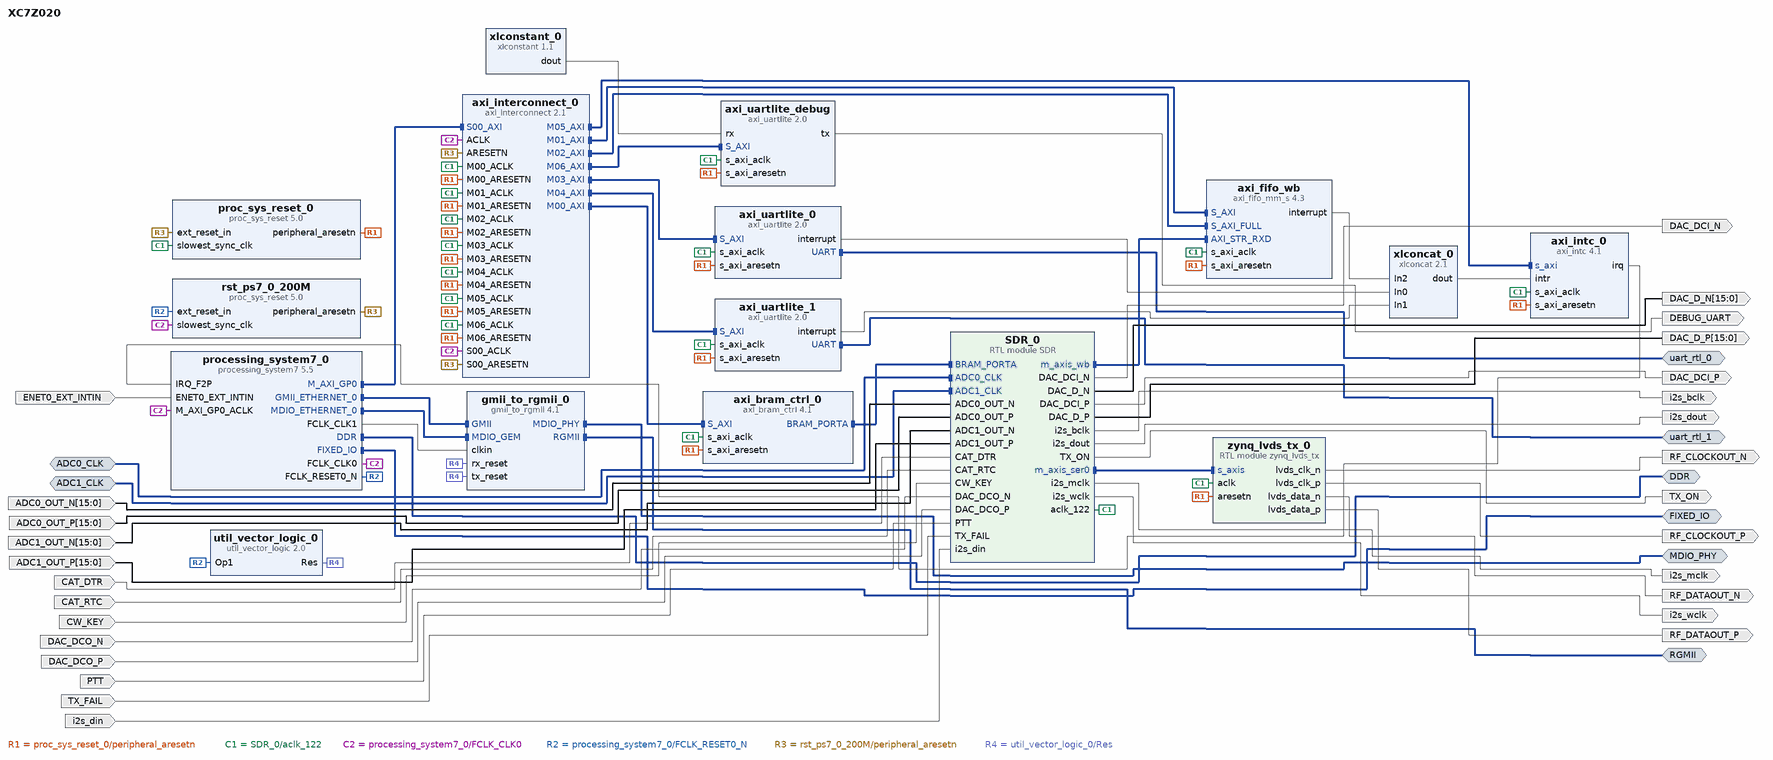
[diagram p0: block diagram of the top level]
# Vivado block design XC7Z020, xc7z020clg484-1, Vivado 2023.2
create_bd_design XC7Z020

create_bd_intf_port -mode Master -vlnv xilinx.com:interface:ddrx_rtl:1.0 DDR
create_bd_intf_port -mode Master -vlnv xilinx.com:display_processing_system7:fixedio_rtl:1.0 FIXED_IO
create_bd_intf_port -mode Slave -vlnv xilinx.com:interface:diff_clock_rtl:1.0 ADC1_CLK
set_property -dict {CONFIG.FREQ_HZ 122880000} [get_bd_intf_ports ADC1_CLK]
create_bd_intf_port -mode Master -vlnv xilinx.com:interface:mdio_rtl:1.0 MDIO_PHY
create_bd_intf_port -mode Master -vlnv xilinx.com:interface:rgmii_rtl:1.0 RGMII
create_bd_intf_port -mode Slave -vlnv xilinx.com:interface:diff_clock_rtl:1.0 ADC0_CLK
set_property -dict {CONFIG.FREQ_HZ 122880000} [get_bd_intf_ports ADC0_CLK]
create_bd_intf_port -mode Master -vlnv xilinx.com:interface:uart_rtl:1.0 uart_rtl_0
create_bd_intf_port -mode Master -vlnv xilinx.com:interface:uart_rtl:1.0 uart_rtl_1
create_bd_port -dir I -type intr ENET0_EXT_INTIN
set_property -dict {CONFIG.SENSITIVITY EDGE_RISING} [get_bd_ports ENET0_EXT_INTIN]
create_bd_port -dir I -from 15 -to 0 ADC0_OUT_N
create_bd_port -dir I -from 15 -to 0 ADC0_OUT_P
create_bd_port -dir I -from 15 -to 0 ADC1_OUT_N
create_bd_port -dir I -from 15 -to 0 ADC1_OUT_P
create_bd_port -dir I DAC_DCO_P
create_bd_port -dir I DAC_DCO_N
create_bd_port -dir I i2s_din
create_bd_port -dir O i2s_dout
create_bd_port -dir O i2s_wclk
create_bd_port -dir O i2s_bclk
create_bd_port -dir O i2s_mclk
create_bd_port -dir O -from 15 -to 0 DAC_D_P
create_bd_port -dir O -from 15 -to 0 DAC_D_N
create_bd_port -dir O DAC_DCI_P
create_bd_port -dir O DAC_DCI_N
create_bd_port -dir I TX_FAIL
create_bd_port -dir O TX_ON
create_bd_port -dir O DEBUG_UART
create_bd_port -dir I PTT
create_bd_port -dir I CW_KEY
create_bd_port -dir I CAT_DTR
create_bd_port -dir I CAT_RTC
create_bd_port -dir O RF_DATAOUT_N
create_bd_port -dir O RF_DATAOUT_P
create_bd_port -dir O RF_CLOCKOUT_N
create_bd_port -dir O RF_CLOCKOUT_P

create_bd_cell -type ip -vlnv xilinx.com:ip:processing_system7:5.5 processing_system7_0
set_property -dict [list \
  CONFIG.PCW_APU_PERIPHERAL_FREQMHZ 666.666666 \
  CONFIG.PCW_ENET0_ENET0_IO EMIO \
  CONFIG.PCW_ENET0_GRP_MDIO_ENABLE 1 \
  CONFIG.PCW_ENET0_GRP_MDIO_IO EMIO \
  CONFIG.PCW_ENET0_PERIPHERAL_ENABLE 1 \
  CONFIG.PCW_ENET_RESET_ENABLE 0 \
  CONFIG.PCW_EN_CLK1_PORT 1 \
  CONFIG.PCW_FCLK_CLK1_BUF TRUE \
  CONFIG.PCW_FPGA0_PERIPHERAL_FREQMHZ 100 \
  CONFIG.PCW_FPGA1_PERIPHERAL_FREQMHZ 200 \
  CONFIG.PCW_FPGA_FCLK1_ENABLE 1 \
  CONFIG.PCW_GPIO_EMIO_GPIO_ENABLE 1 \
  CONFIG.PCW_GPIO_EMIO_GPIO_IO 7 \
  CONFIG.PCW_GPIO_EMIO_GPIO_WIDTH 7 \
  CONFIG.PCW_GPIO_MIO_GPIO_ENABLE 1 \
  CONFIG.PCW_GPIO_MIO_GPIO_IO MIO \
  CONFIG.PCW_I2C0_GRP_INT_ENABLE 0 \
  CONFIG.PCW_I2C0_I2C0_IO {MIO 14 .. 15} \
  CONFIG.PCW_I2C0_PERIPHERAL_ENABLE 1 \
  CONFIG.PCW_I2C_PERIPHERAL_FREQMHZ 111.111115 \
  CONFIG.PCW_I2C_RESET_ENABLE 0 \
  CONFIG.PCW_IRQ_F2P_INTR 1 \
  CONFIG.PCW_PERIPHERAL_BOARD_PRESET None \
  CONFIG.PCW_PRESET_BANK1_VOLTAGE {LVCMOS 3.3V} \
  CONFIG.PCW_QSPI_GRP_SINGLE_SS_ENABLE 1 \
  CONFIG.PCW_QSPI_GRP_SINGLE_SS_IO {MIO 1 .. 6} \
  CONFIG.PCW_QSPI_PERIPHERAL_ENABLE 1 \
  CONFIG.PCW_QSPI_QSPI_IO {MIO 1 .. 6} \
  CONFIG.PCW_SD0_PERIPHERAL_ENABLE 0 \
  CONFIG.PCW_SINGLE_QSPI_DATA_MODE x4 \
  CONFIG.PCW_SPI0_PERIPHERAL_ENABLE 1 \
  CONFIG.PCW_SPI0_SPI0_IO {MIO 16 .. 21} \
  CONFIG.PCW_SPI1_GRP_SS1_ENABLE 1 \
  CONFIG.PCW_SPI1_GRP_SS2_ENABLE 1 \
  CONFIG.PCW_SPI1_PERIPHERAL_ENABLE 1 \
  CONFIG.PCW_SPI1_SPI1_IO {MIO 34 .. 39} \
  CONFIG.PCW_TTC0_PERIPHERAL_ENABLE 1 \
  CONFIG.PCW_TTC0_TTC0_IO EMIO \
  CONFIG.PCW_UART0_PERIPHERAL_ENABLE 1 \
  CONFIG.PCW_UART0_UART0_IO {MIO 10 .. 11} \
  CONFIG.PCW_UART1_PERIPHERAL_ENABLE 1 \
  CONFIG.PCW_UART1_UART1_IO {MIO 48 .. 49} \
  CONFIG.PCW_UART_PERIPHERAL_FREQMHZ 100 \
  CONFIG.PCW_UIPARAM_DDR_BUS_WIDTH {16 Bit} \
  CONFIG.PCW_UIPARAM_DDR_FREQ_MHZ 533.333333 \
  CONFIG.PCW_UIPARAM_DDR_PARTNO {MT41K256M16 RE-125} \
  CONFIG.PCW_USB0_PERIPHERAL_ENABLE 0 \
  CONFIG.PCW_USB_RESET_ENABLE 0 \
  CONFIG.PCW_USE_FABRIC_INTERRUPT 1 \
  CONFIG.preset None \
] [get_bd_cells processing_system7_0]
# 515 more settings of processing_system7_0 are not shown: defaults, MIO pin electricals, DDR timing, and values the tool derives
create_bd_cell -type ip -vlnv xilinx.com:ip:gmii_to_rgmii:4.1 gmii_to_rgmii_0
set_property -dict {CONFIG.RGMII_TXC_SKEW 2 CONFIG.SupportLevel Include_Shared_Logic_in_Core} [get_bd_cells gmii_to_rgmii_0]
create_bd_cell -type ip -vlnv xilinx.com:ip:util_vector_logic:2.0 util_vector_logic_0
set_property -dict {CONFIG.C_OPERATION not CONFIG.C_SIZE 1} [get_bd_cells util_vector_logic_0]
create_bd_cell -type ip -vlnv xilinx.com:ip:axi_bram_ctrl:4.1 axi_bram_ctrl_0
set_property -dict {CONFIG.SINGLE_PORT_BRAM 1} [get_bd_cells axi_bram_ctrl_0]
create_bd_cell -type ip -vlnv xilinx.com:ip:proc_sys_reset:5.0 rst_ps7_0_200M
create_bd_cell -type ip -vlnv xilinx.com:ip:axi_interconnect:2.1 axi_interconnect_0
set_property -dict [list \
  CONFIG.ENABLE_ADVANCED_OPTIONS 1 \
  CONFIG.NUM_MI 7 \
  CONFIG.S00_HAS_DATA_FIFO 2 \
  CONFIG.STRATEGY 1 \
] [get_bd_cells axi_interconnect_0]
create_bd_cell -type ip -vlnv xilinx.com:ip:proc_sys_reset:5.0 proc_sys_reset_0
create_bd_cell -type ip -vlnv xilinx.com:ip:axi_fifo_mm_s:4.3 axi_fifo_wb
set_property -dict [list \
  CONFIG.C_DATA_INTERFACE_TYPE 1 \
  CONFIG.C_RX_FIFO_DEPTH 2048 \
  CONFIG.C_RX_FIFO_PE_THRESHOLD 5 \
  CONFIG.C_RX_FIFO_PF_THRESHOLD 512 \
  CONFIG.C_USE_TX_CTRL 0 \
  CONFIG.C_USE_TX_DATA 0 \
] [get_bd_cells axi_fifo_wb]
create_bd_cell -type module -reference SDR SDR_0
create_bd_cell -type ip -vlnv xilinx.com:ip:axi_uartlite:2.0 axi_uartlite_0
set_property -dict {CONFIG.C_BAUDRATE 115200 CONFIG.C_S_AXI_ACLK_FREQ_HZ 122880000} [get_bd_cells axi_uartlite_0]
create_bd_cell -type ip -vlnv xilinx.com:ip:axi_uartlite:2.0 axi_uartlite_1
set_property -dict {CONFIG.C_BAUDRATE 115200 CONFIG.C_S_AXI_ACLK_FREQ_HZ 122880000} [get_bd_cells axi_uartlite_1]
create_bd_cell -type ip -vlnv xilinx.com:ip:axi_intc:4.1 axi_intc_0
set_property -dict [list \
  CONFIG.C_IRQ_IS_LEVEL 0 \
  CONFIG.C_PROCESSOR_CLK_FREQ_MHZ 200 \
  CONFIG.C_S_AXI_ACLK_FREQ_MHZ 122.88 \
] [get_bd_cells axi_intc_0]
create_bd_cell -type ip -vlnv xilinx.com:ip:axi_uartlite:2.0 axi_uartlite_debug
set_property -dict {CONFIG.C_BAUDRATE 115200 CONFIG.C_S_AXI_ACLK_FREQ_HZ 122880000} [get_bd_cells axi_uartlite_debug]
create_bd_cell -type ip -vlnv xilinx.com:ip:xlconstant:1.1 xlconstant_0
create_bd_cell -type ip -vlnv xilinx.com:ip:xlconcat:2.1 xlconcat_0
set_property -dict {CONFIG.NUM_PORTS 3} [get_bd_cells xlconcat_0]
create_bd_cell -type module -reference zynq_lvds_tx zynq_lvds_tx_0

# ---- connections ----

connect_bd_intf_net [get_bd_intf_ports ADC0_CLK] [get_bd_intf_pins SDR_0/ADC0_CLK]
connect_bd_intf_net [get_bd_intf_ports ADC1_CLK] [get_bd_intf_pins SDR_0/ADC1_CLK]
connect_bd_intf_net [get_bd_intf_pins SDR_0/m_axis_ser0] [get_bd_intf_pins zynq_lvds_tx_0/s_axis]
connect_bd_intf_net -intf_net SDR_1_m_axis_wb [get_bd_intf_pins axi_fifo_wb/AXI_STR_RXD] [get_bd_intf_pins SDR_0/m_axis_wb]
connect_bd_intf_net [get_bd_intf_pins axi_bram_ctrl_0/BRAM_PORTA] [get_bd_intf_pins SDR_0/BRAM_PORTA]
connect_bd_intf_net [get_bd_intf_pins axi_interconnect_0/M00_AXI] [get_bd_intf_pins axi_bram_ctrl_0/S_AXI]
connect_bd_intf_net [get_bd_intf_pins axi_interconnect_0/M01_AXI] [get_bd_intf_pins axi_fifo_wb/S_AXI]
connect_bd_intf_net [get_bd_intf_pins axi_interconnect_0/M02_AXI] [get_bd_intf_pins axi_fifo_wb/S_AXI_FULL]
connect_bd_intf_net [get_bd_intf_pins axi_interconnect_0/M03_AXI] [get_bd_intf_pins axi_uartlite_0/S_AXI]
connect_bd_intf_net [get_bd_intf_pins axi_interconnect_0/M04_AXI] [get_bd_intf_pins axi_uartlite_1/S_AXI]
connect_bd_intf_net [get_bd_intf_pins axi_interconnect_0/M05_AXI] [get_bd_intf_pins axi_intc_0/s_axi]
connect_bd_intf_net [get_bd_intf_pins axi_interconnect_0/M06_AXI] [get_bd_intf_pins axi_uartlite_debug/S_AXI]
connect_bd_intf_net [get_bd_intf_ports uart_rtl_0] [get_bd_intf_pins axi_uartlite_0/UART]
connect_bd_intf_net [get_bd_intf_ports uart_rtl_1] [get_bd_intf_pins axi_uartlite_1/UART]
connect_bd_intf_net [get_bd_intf_pins gmii_to_rgmii_0/MDIO_PHY] [get_bd_intf_ports MDIO_PHY]
connect_bd_intf_net [get_bd_intf_pins gmii_to_rgmii_0/RGMII] [get_bd_intf_ports RGMII]
connect_bd_intf_net [get_bd_intf_ports DDR] [get_bd_intf_pins processing_system7_0/DDR]
connect_bd_intf_net [get_bd_intf_ports FIXED_IO] [get_bd_intf_pins processing_system7_0/FIXED_IO]
connect_bd_intf_net [get_bd_intf_pins processing_system7_0/GMII_ETHERNET_0] [get_bd_intf_pins gmii_to_rgmii_0/GMII]
connect_bd_intf_net [get_bd_intf_pins processing_system7_0/MDIO_ETHERNET_0] [get_bd_intf_pins gmii_to_rgmii_0/MDIO_GEM]
connect_bd_intf_net [get_bd_intf_pins processing_system7_0/M_AXI_GP0] [get_bd_intf_pins axi_interconnect_0/S00_AXI]
connect_bd_net [get_bd_ports ADC0_OUT_N] [get_bd_pins SDR_0/ADC0_OUT_N]
connect_bd_net [get_bd_ports ADC0_OUT_P] [get_bd_pins SDR_0/ADC0_OUT_P]
connect_bd_net [get_bd_ports ADC1_OUT_N] [get_bd_pins SDR_0/ADC1_OUT_N]
connect_bd_net [get_bd_ports ADC1_OUT_P] [get_bd_pins SDR_0/ADC1_OUT_P]
connect_bd_net [get_bd_ports CAT_DTR] [get_bd_pins SDR_0/CAT_DTR]
connect_bd_net [get_bd_ports CAT_RTC] [get_bd_pins SDR_0/CAT_RTC]
connect_bd_net [get_bd_ports CW_KEY] [get_bd_pins SDR_0/CW_KEY]
connect_bd_net [get_bd_ports DAC_DCO_N] [get_bd_pins SDR_0/DAC_DCO_N]
connect_bd_net [get_bd_ports DAC_DCO_P] [get_bd_pins SDR_0/DAC_DCO_P]
connect_bd_net [get_bd_ports ENET0_EXT_INTIN] [get_bd_pins processing_system7_0/ENET0_EXT_INTIN]
connect_bd_net -net M00_ARESETN_1 [get_bd_pins proc_sys_reset_0/peripheral_aresetn] \
  [get_bd_pins axi_bram_ctrl_0/s_axi_aresetn] [get_bd_pins axi_intc_0/s_axi_aresetn] [get_bd_pins axi_fifo_wb/s_axi_aresetn] \
  [get_bd_pins axi_interconnect_0/M00_ARESETN] [get_bd_pins axi_interconnect_0/M01_ARESETN] \
  [get_bd_pins axi_interconnect_0/M02_ARESETN] [get_bd_pins axi_interconnect_0/M03_ARESETN] \
  [get_bd_pins axi_interconnect_0/M04_ARESETN] [get_bd_pins axi_interconnect_0/M05_ARESETN] \
  [get_bd_pins axi_interconnect_0/M06_ARESETN] [get_bd_pins axi_uartlite_0/s_axi_aresetn] \
  [get_bd_pins axi_uartlite_1/s_axi_aresetn] [get_bd_pins axi_uartlite_debug/s_axi_aresetn] \
  [get_bd_pins zynq_lvds_tx_0/aresetn]
connect_bd_net [get_bd_ports PTT] [get_bd_pins SDR_0/PTT]
connect_bd_net [get_bd_pins SDR_0/aclk_122] \
  [get_bd_pins proc_sys_reset_0/slowest_sync_clk] [get_bd_pins axi_bram_ctrl_0/s_axi_aclk] \
  [get_bd_pins axi_intc_0/s_axi_aclk] [get_bd_pins axi_fifo_wb/s_axi_aclk] [get_bd_pins axi_interconnect_0/M00_ACLK] \
  [get_bd_pins axi_interconnect_0/M01_ACLK] [get_bd_pins axi_interconnect_0/M02_ACLK] \
  [get_bd_pins axi_interconnect_0/M03_ACLK] [get_bd_pins axi_interconnect_0/M04_ACLK] \
  [get_bd_pins axi_interconnect_0/M05_ACLK] [get_bd_pins axi_interconnect_0/M06_ACLK] [get_bd_pins axi_uartlite_0/s_axi_aclk] \
  [get_bd_pins axi_uartlite_1/s_axi_aclk] [get_bd_pins axi_uartlite_debug/s_axi_aclk] [get_bd_pins zynq_lvds_tx_0/aclk]
connect_bd_net -net SDR_1_DAC_DCI_N [get_bd_pins SDR_0/DAC_DCI_N] [get_bd_ports DAC_DCI_N]
connect_bd_net -net SDR_1_DAC_DCI_P [get_bd_pins SDR_0/DAC_DCI_P] [get_bd_ports DAC_DCI_P]
connect_bd_net -net SDR_1_DAC_D_N [get_bd_pins SDR_0/DAC_D_N] [get_bd_ports DAC_D_N]
connect_bd_net -net SDR_1_DAC_D_P [get_bd_pins SDR_0/DAC_D_P] [get_bd_ports DAC_D_P]
connect_bd_net -net SDR_1_TX_ON [get_bd_pins SDR_0/TX_ON] [get_bd_ports TX_ON]
connect_bd_net -net SDR_1_i2s_bclk [get_bd_pins SDR_0/i2s_bclk] [get_bd_ports i2s_bclk]
connect_bd_net -net SDR_1_i2s_dout [get_bd_pins SDR_0/i2s_dout] [get_bd_ports i2s_dout]
connect_bd_net -net SDR_1_i2s_mclk [get_bd_pins SDR_0/i2s_mclk] [get_bd_ports i2s_mclk]
connect_bd_net -net SDR_1_i2s_wclk [get_bd_pins SDR_0/i2s_wclk] [get_bd_ports i2s_wclk]
connect_bd_net [get_bd_ports TX_FAIL] [get_bd_pins SDR_0/TX_FAIL]
connect_bd_net [get_bd_pins axi_fifo_wb/interrupt] [get_bd_pins xlconcat_0/In2]
connect_bd_net [get_bd_pins axi_intc_0/irq] [get_bd_pins processing_system7_0/IRQ_F2P]
connect_bd_net [get_bd_pins axi_uartlite_0/interrupt] [get_bd_pins xlconcat_0/In0]
connect_bd_net [get_bd_pins axi_uartlite_1/interrupt] [get_bd_pins xlconcat_0/In1]
connect_bd_net -net axi_uartlite_2_tx [get_bd_pins axi_uartlite_debug/tx] [get_bd_ports DEBUG_UART]
connect_bd_net [get_bd_ports i2s_din] [get_bd_pins SDR_0/i2s_din]
connect_bd_net [get_bd_pins processing_system7_0/FCLK_CLK0] \
  [get_bd_pins processing_system7_0/M_AXI_GP0_ACLK] [get_bd_pins rst_ps7_0_200M/slowest_sync_clk] \
  [get_bd_pins axi_interconnect_0/ACLK] [get_bd_pins axi_interconnect_0/S00_ACLK]
connect_bd_net [get_bd_pins processing_system7_0/FCLK_CLK1] [get_bd_pins gmii_to_rgmii_0/clkin]
connect_bd_net [get_bd_pins processing_system7_0/FCLK_RESET0_N] [get_bd_pins util_vector_logic_0/Op1] [get_bd_pins rst_ps7_0_200M/ext_reset_in]
connect_bd_net [get_bd_pins rst_ps7_0_200M/peripheral_aresetn] \
  [get_bd_pins proc_sys_reset_0/ext_reset_in] [get_bd_pins axi_interconnect_0/ARESETN] \
  [get_bd_pins axi_interconnect_0/S00_ARESETN]
connect_bd_net [get_bd_pins util_vector_logic_0/Res] [get_bd_pins gmii_to_rgmii_0/tx_reset] [get_bd_pins gmii_to_rgmii_0/rx_reset]
connect_bd_net [get_bd_pins xlconcat_0/dout] [get_bd_pins axi_intc_0/intr]
connect_bd_net [get_bd_pins xlconstant_0/dout] [get_bd_pins axi_uartlite_debug/rx]
connect_bd_net [get_bd_pins zynq_lvds_tx_0/lvds_clk_n] [get_bd_ports RF_CLOCKOUT_N]
connect_bd_net [get_bd_pins zynq_lvds_tx_0/lvds_clk_p] [get_bd_ports RF_CLOCKOUT_P]
connect_bd_net [get_bd_pins zynq_lvds_tx_0/lvds_data_n] [get_bd_ports RF_DATAOUT_N]
connect_bd_net [get_bd_pins zynq_lvds_tx_0/lvds_data_p] [get_bd_ports RF_DATAOUT_P]

# ---- address map ----
assign_bd_address -offset 0x40000000 -range 8K -target_address_space [get_bd_addr_spaces processing_system7_0/Data] [get_bd_addr_segs axi_bram_ctrl_0/S_AXI/Mem0]
assign_bd_address -offset 0x41800000 -range 64K -target_address_space [get_bd_addr_spaces processing_system7_0/Data] [get_bd_addr_segs axi_intc_0/S_AXI/Reg]
assign_bd_address -offset 0x42C00000 -range 64K -target_address_space [get_bd_addr_spaces processing_system7_0/Data] [get_bd_addr_segs axi_uartlite_0/S_AXI/Reg]
assign_bd_address -offset 0x42C10000 -range 64K -target_address_space [get_bd_addr_spaces processing_system7_0/Data] [get_bd_addr_segs axi_uartlite_1/S_AXI/Reg]
assign_bd_address -offset 0x42C20000 -range 64K -target_address_space [get_bd_addr_spaces processing_system7_0/Data] [get_bd_addr_segs axi_uartlite_debug/S_AXI/Reg]
assign_bd_address -offset 0x43C00000 -range 64K -target_address_space [get_bd_addr_spaces processing_system7_0/Data] [get_bd_addr_segs axi_fifo_wb/S_AXI/Mem0]
assign_bd_address -offset 0x43C10000 -range 64K -target_address_space [get_bd_addr_spaces processing_system7_0/Data] [get_bd_addr_segs axi_fifo_wb/S_AXI_FULL/Mem1]

validate_bd_design
save_bd_design
